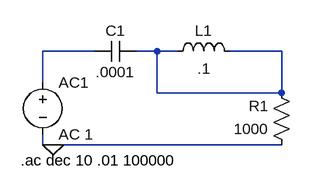
[diagram p0: schematic Draft5.asc]
Draft5.asc, the LTspice schematic file:
Version 4
SHEET 1 880 680
WIRE 112 96 32 96
WIRE 208 96 176 96
WIRE 240 96 208 96
WIRE 400 96 320 96
WIRE 32 144 32 96
WIRE 208 160 208 96
WIRE 400 160 400 96
WIRE 400 160 208 160
WIRE 32 240 32 224
WIRE 48 240 32 240
WIRE 400 240 48 240
FLAG 48 240 0
SYMBOL res 416 256 R180
WINDOW 0 36 76 Left 2
WINDOW 3 36 40 Left 2
SYMATTR InstName R1
SYMATTR Value 1000
SYMBOL cap 176 80 R90
WINDOW 0 0 32 VBottom 2
WINDOW 3 32 32 VTop 2
SYMATTR InstName C1
SYMATTR Value .0001
SYMBOL ind 224 112 R270
WINDOW 0 32 56 VTop 2
WINDOW 3 5 56 VBottom 2
SYMATTR InstName L1
SYMATTR Value .1
SYMBOL voltage 32 128 R0
WINDOW 123 0 0 Left 0
WINDOW 39 0 0 Left 0
SYMATTR InstName AC1
SYMATTR Value AC 1
TEXT -2 264 Left 2 !.ac dec 10 .01 100000

The netlist it stands for:
* Draft5.asc
R1 0 N002 1000
C1 N002 N001 .0001
L1 N002 N002 .1
V§AC1 N001 0 AC 1
.ac dec 10 .01 100000
.backanno
.end